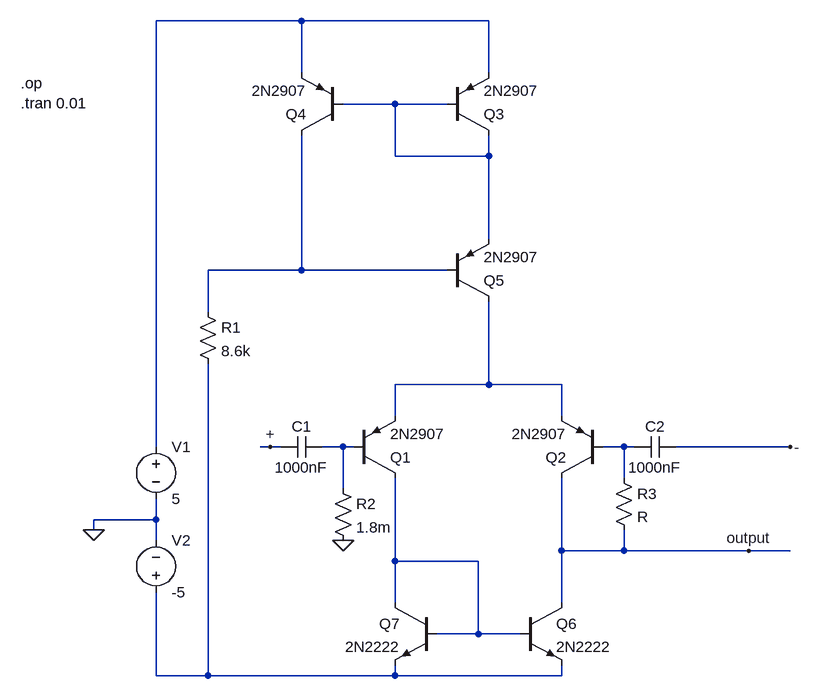
[diagram p0: schematic Full Input Stage.asc]
Full Input Stage.asc, the LTspice schematic file:
Version 4
SHEET 1 936 680
WIRE -240 -480 -464 -480
WIRE 48 -480 -240 -480
WIRE -240 -400 -240 -480
WIRE 48 -400 48 -480
WIRE -96 -352 -176 -352
WIRE -16 -352 -96 -352
WIRE -96 -272 -96 -352
WIRE 48 -272 48 -304
WIRE 48 -272 -96 -272
WIRE 48 -144 48 -272
WIRE -240 -96 -240 -304
WIRE -240 -96 -384 -96
WIRE -16 -96 -240 -96
WIRE -384 -32 -384 -96
WIRE 48 80 48 -48
WIRE 48 80 -96 80
WIRE 160 80 48 80
WIRE -96 128 -96 80
WIRE 160 128 160 80
WIRE -464 176 -464 -480
WIRE -288 176 -304 176
WIRE -272 176 -288 176
WIRE -176 176 -208 176
WIRE -160 176 -176 176
WIRE 256 176 224 176
WIRE 272 176 256 176
WIRE 512 176 336 176
WIRE 256 224 256 176
WIRE -176 240 -176 176
WIRE -464 288 -464 256
WIRE -464 288 -560 288
WIRE -560 304 -560 288
WIRE -464 320 -464 288
WIRE 160 336 160 224
WIRE 256 336 256 304
WIRE 256 336 160 336
WIRE 448 336 256 336
WIRE 512 336 448 336
WIRE -96 352 -96 224
WIRE 32 352 -96 352
WIRE -96 416 -96 352
WIRE 160 416 160 336
WIRE 32 464 32 352
WIRE 32 464 -32 464
WIRE 96 464 32 464
WIRE -464 528 -464 400
WIRE -384 528 -384 48
WIRE -384 528 -464 528
WIRE -96 528 -96 512
WIRE -96 528 -384 528
WIRE 160 528 160 512
WIRE 160 528 -96 528
FLAG -560 304 0
FLAG 448 336 output
FLAG -176 320 0
FLAG 512 176 -
FLAG -288 176 +
SYMBOL pnp -160 224 M180
SYMATTR InstName Q1
SYMATTR Value 2N2907
SYMBOL pnp 224 224 R180
SYMATTR InstName Q2
SYMATTR Value 2N2907
SYMBOL voltage -464 160 R0
SYMATTR InstName V1
SYMATTR Value 5
SYMBOL voltage -464 416 M180
WINDOW 0 24 96 Left 2
WINDOW 3 24 16 Left 2
SYMATTR InstName V2
SYMATTR Value -5
SYMBOL pnp -16 -304 M180
SYMATTR InstName Q3
SYMATTR Value 2N2907
SYMBOL pnp -176 -304 R180
SYMATTR InstName Q4
SYMATTR Value 2N2907
SYMBOL pnp -16 -48 M180
SYMATTR InstName Q5
SYMATTR Value 2N2907
SYMBOL res -400 -48 R0
SYMATTR InstName R1
SYMATTR Value 8.6k
SYMBOL cap -208 160 R90
WINDOW 0 0 32 VBottom 2
WINDOW 3 32 32 VTop 2
SYMATTR InstName C1
SYMATTR Value 1000nF
SYMBOL cap 336 160 R90
WINDOW 0 0 32 VBottom 2
WINDOW 3 32 32 VTop 2
SYMATTR InstName C2
SYMATTR Value 1000nF
SYMBOL res -192 224 R0
SYMATTR InstName R2
SYMATTR Value 1.8m
SYMBOL res 240 208 R0
SYMATTR InstName R3
SYMBOL npn 96 416 R0
SYMATTR InstName Q6
SYMATTR Value 2N2222
SYMBOL npn -32 416 M0
SYMATTR InstName Q7
SYMATTR Value 2N2222
TEXT -672 -384 Left 2 !.op\n.tran 0.01

The netlist it stands for:
* Full Input Stage.asc
Q1 N007 N005 N004 0 2N2907
Q2 output N006 N004 0 2N2907
V1 N001 0 5
V2 N008 0 -5
Q3 N002 N002 N001 0 2N2907
Q4 N003 N002 N001 0 2N2907
Q5 N004 N003 N002 0 2N2907
R1 N003 N008 8.6k
C1 N005 + 1000nF
C2 - N006 1000nF
R2 N005 0 1.8m
R3 N006 output R
Q6 output N007 N008 0 2N2222
Q7 N007 N007 N008 0 2N2222
.model NPN NPN
.model PNP PNP
.lib standard.bjt
.op
.tran 0.01
.backanno
.end